# EAGLE design BT121breakout (EAGLE 7.7.0)
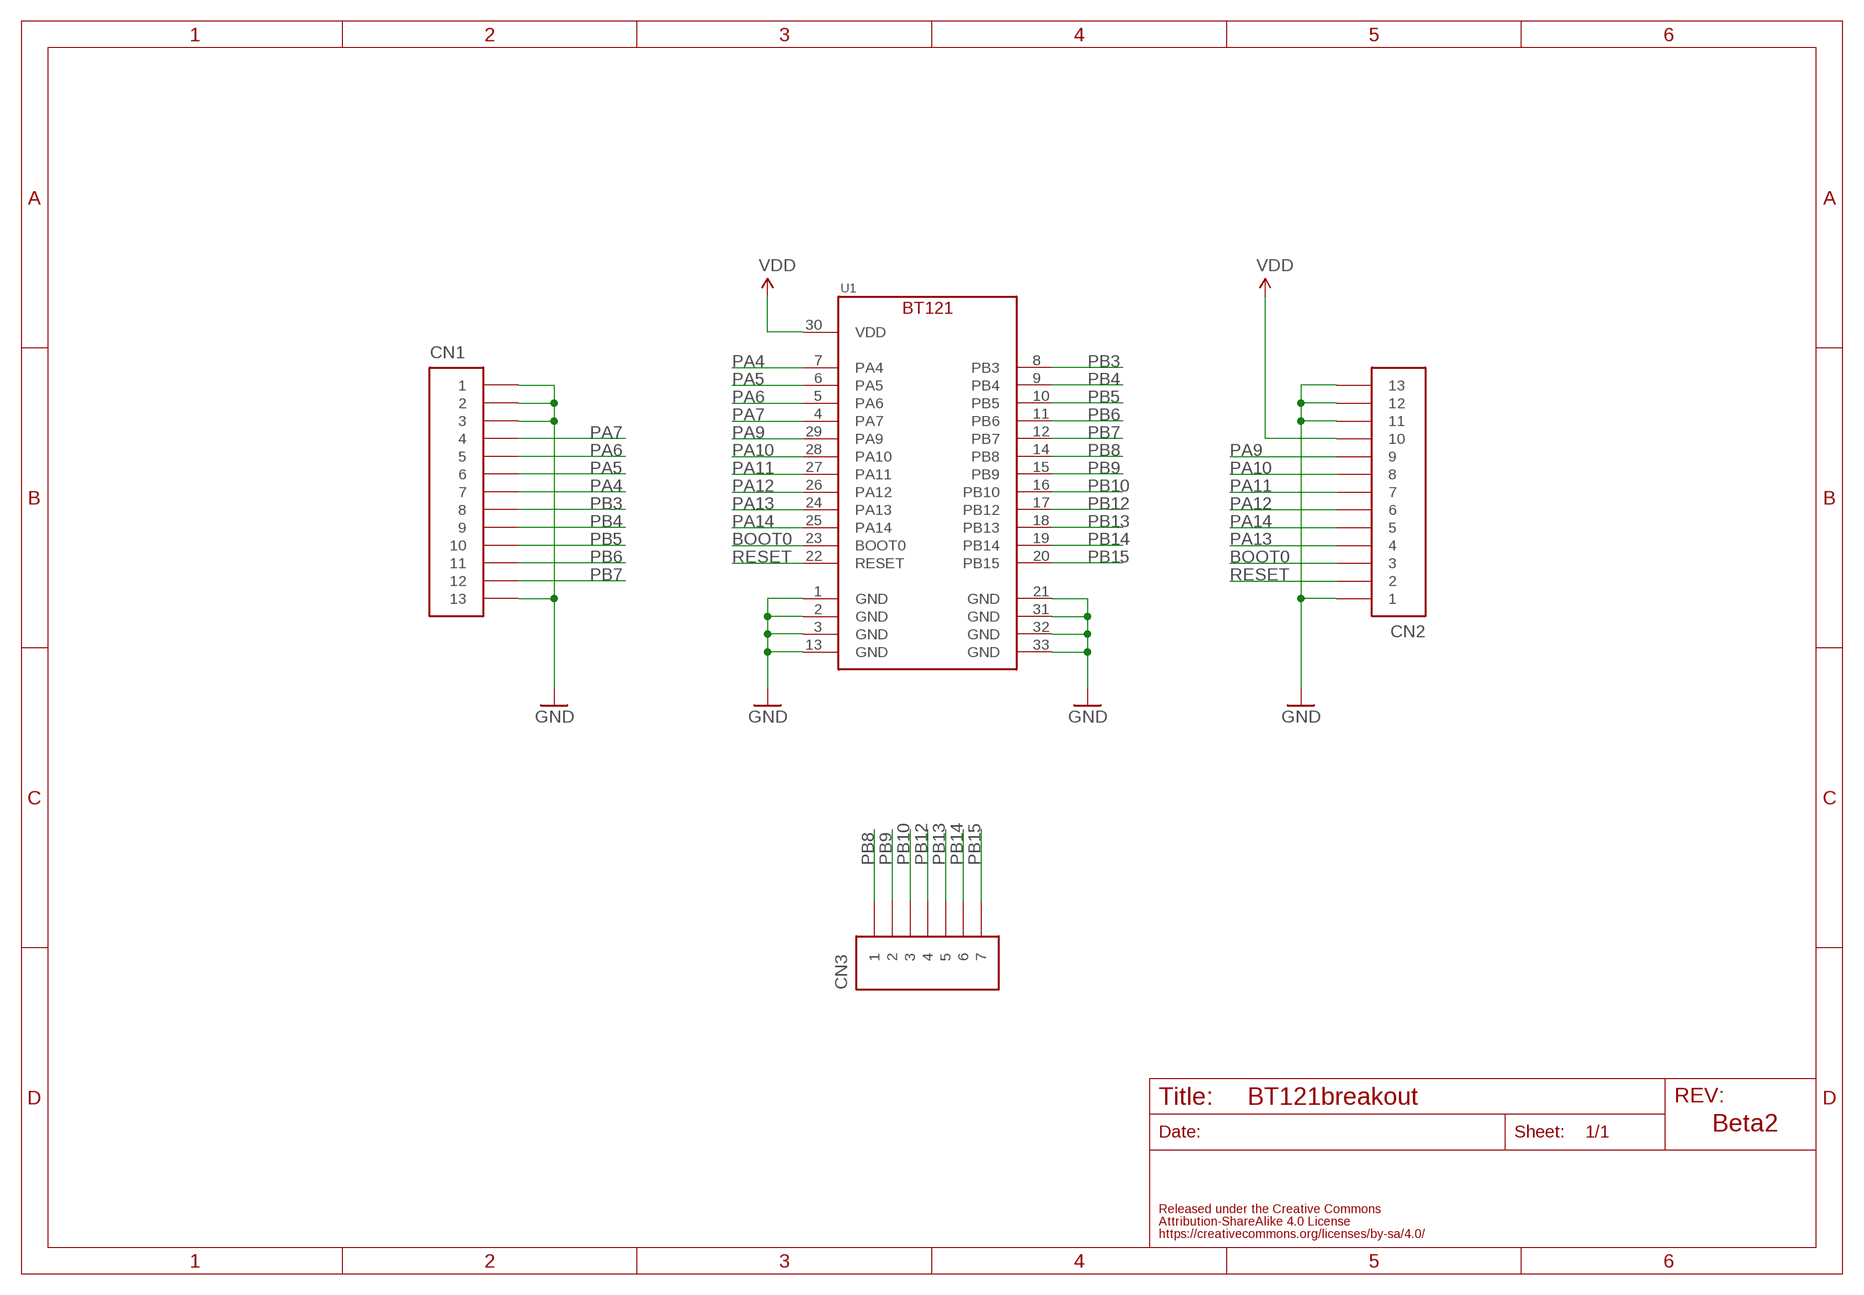
[diagram p0: schematic, sheet 1]

## Parts
CN1  PIN_HEADER_1X13  [PIN_1X13]
CN2  PIN_HEADER_1X13  [PIN_1X13]
CN3  PIN_HEADER_1X7  [PIN_1X7]
U1  SILICONLABS-BT121  [SILICONLABS-BT121]

## Nets
BOOT0: CN2.3 U1.23(BOOT0)
GND: CN1.1 CN1.2 CN1.3 CN1.13 CN2.1 CN2.11 CN2.12 CN2.13 U1.1(GND) U1.2(GND) U1.3(GND) U1.13(GND) U1.21(GND) U1.31(GND) U1.32(GND) U1.33(GND)
PA4: CN1.7 U1.7(PA4)
PA5: CN1.6 U1.6(PA5)
PA6: CN1.5 U1.5(PA6)
PA7: CN1.4 U1.4(PA7)
PA9: CN2.9 U1.29(PA9)
PA10: CN2.8 U1.28(PA10)
PA11: CN2.7 U1.27(PA11)
PA12: CN2.6 U1.26(PA12)
PA13: CN2.4 U1.24(PA13)
PA14: CN2.5 U1.25(PA14)
PB3: CN1.8 U1.8(PB3)
PB4: CN1.9 U1.9(PB4)
PB5: CN1.10 U1.10(PB5)
PB6: CN1.11 U1.11(PB6)
PB7: CN1.12 U1.12(PB7)
PB8: CN3.1 U1.14(PB8)
PB9: CN3.2 U1.15(PB9)
PB10: CN3.3 U1.16(PB10)
PB12: CN3.4 U1.17(PB12)
PB13: CN3.5 U1.18(PB13)
PB14: CN3.6 U1.19(PB14)
PB15: CN3.7 U1.20(PB15)
RESET: CN2.2 U1.22(RESET)
VDD: CN2.10 U1.30(VDD)

## Notes on the sheet
- Beta2

## Library data of the parts
CN1 CN2 = FaBo-PIN:PIN_HEADER_1X13
CN3 = FaBo-PIN:PIN_HEADER_1X7
U1 = FaBo-BT:SILICONLABS-BT121

## Board
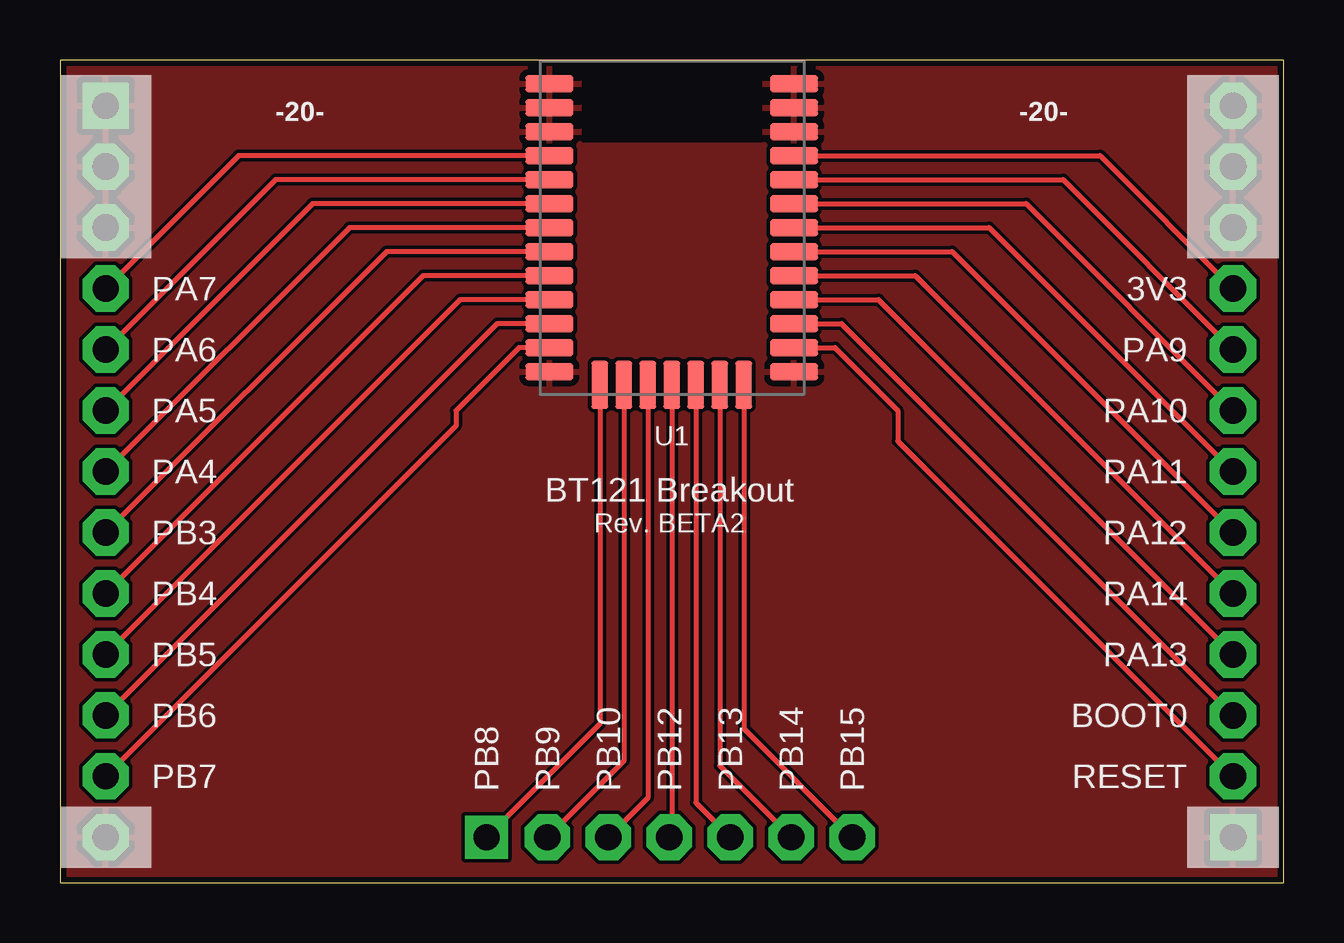
[diagram p1: board, top side]
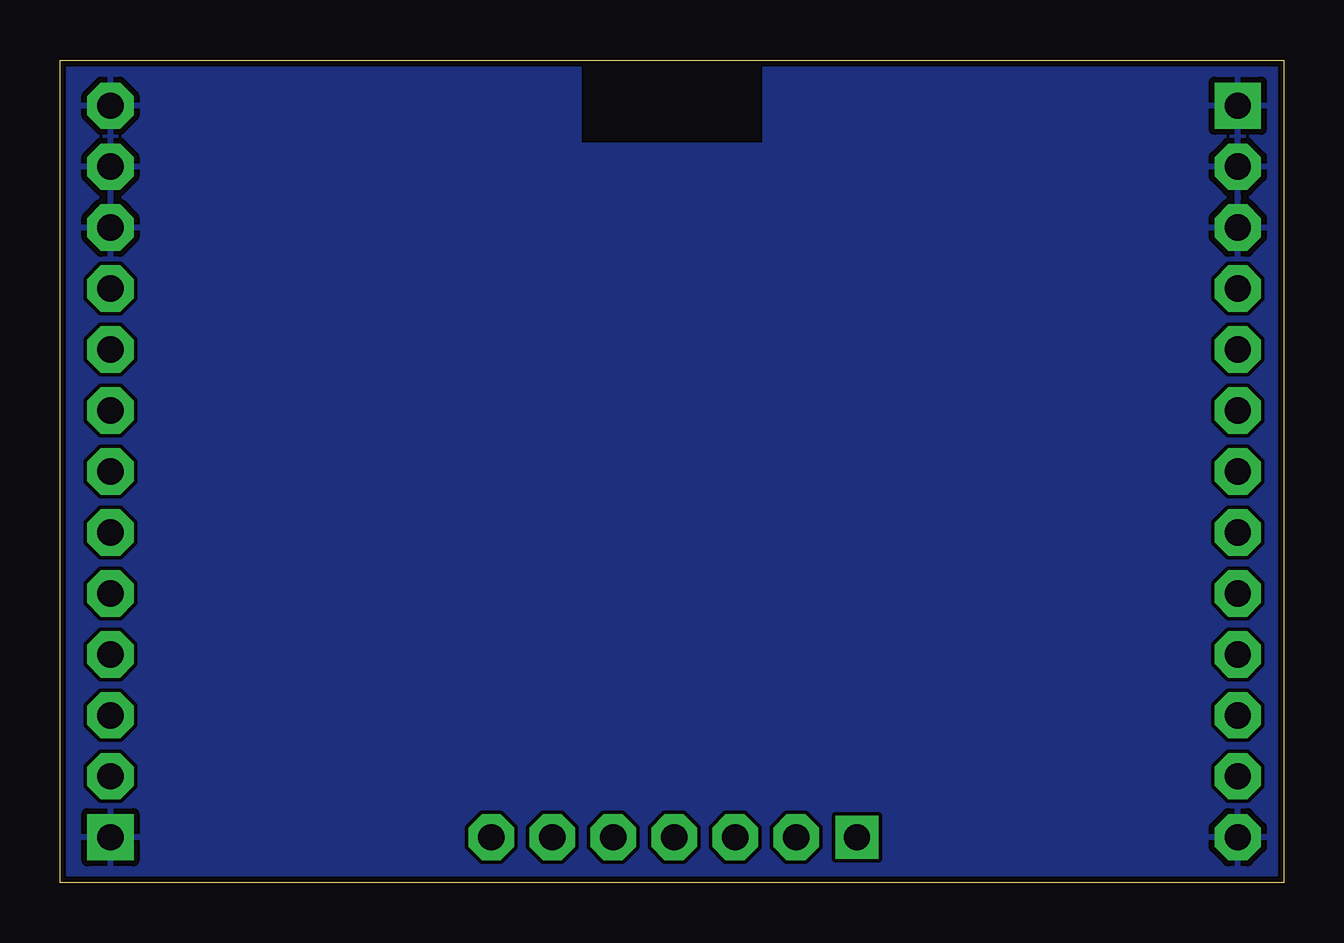
[diagram p2: board, bottom side, seen from below]

Size 51 x 34.29 mm. Coordinates in mm from the lower left corner, seen from the top.
Outline: 0,0 51,0 51,34.29 0,34.29 0,0
Copper layers (1*16): Top 0.035mm / dielectric 1.5mm / Bottom 0.035mm
Design rules "Elecrow_angle": minimum track width 6mil, minimum drill 12mil, track to track 6mil, track to pad 6mil, pad to pad 6mil, via to via 6mil, smd to smd 0mil, copper to edge 10mil, drill to drill 10mil, minimum pad ring 10mil, minimum via ring 6mil, stop-mask expansion 2mil, vias tented up to drill 100mil, thermal gap 10mil

### Footprints (pad centres in the part's own frame; a part is rotated, then mirrored left to right if it is on the bottom)
PIN_1X13 = drill 1.1 pad 1.93 square: 1 -15.24,0 | drill 1.1 pad 1.93 octagon: 2 -12.7,0; 3 -10.16,0; 4 -7.62,0; 5 -5.08,0; 6 -2.54,0; 7 0,0; 8 2.54,0; 9 5.08,0; 10 7.62,0; 11 10.16,0; 12 12.7,0; 13 15.24,0
PIN_1X7 = drill 1.1 pad 1.778 square: 1 -7.62,0 | drill 1.1 pad 1.9 octagon: 2 -5.08,0; 3 -2.54,0; 4 0,0; 5 2.54,0; 6 5.08,0; 7 7.62,0
SILICONLABS-BT121 = smd 2 x 0.7: 1 -5.1,6; 2 -5.1,5; 3 -5.1,4; 4 -5.1,3; 5 -5.1,2; 6 -5.1,1; 7 -5.1,0; 8 -5.1,-1; 9 -5.1,-2; 10 -5.1,-3; 11 -5.1,-4; 12 -5.1,-5; 13 -5.1,-6; 21 5.1,-6; 22 5.1,-5; 23 5.1,-4; 24 5.1,-3; 25 5.1,-2; 26 5.1,-1; 27 5.1,0; 28 5.1,1; 29 5.1,2; 30 5.1,3; 31 5.1,4; 32 5.1,5; 33 5.1,6 | smd 0.7 x 2: 14 -3,-6.55; 15 -2,-6.55; 16 -1,-6.55; 17 0,-6.55; 18 1,-6.55; 19 2,-6.55; 20 3,-6.55

### Placement (x,y rotation side)
CN1  1.91,17.14 270 top
CN2  48.9,17.14 90 top
CN3  25.4,1.91 0 top
U1  25.5,27.3 0 top

### Tracks (layer width: path | path; a pad name or v marks a point on that pad's centre or on a via)
BOOT0
  Top 0.203: U1.23 32.58,23.3 CN2.3
GND
  pour Bottom: 0,0 51,0 51,34.29 0,34.29
  pour Top: 0,0 51,0 51,34.29 0,34.29
PA4
  Top 0.203: U1.7 12.06,27.3 CN1.7
PA5
  Top 0.203: U1.6 10.53,28.3 CN1.6
PA6
  Top 0.203: U1.5 8.98,29.3 CN1.5
PA7
  Top 0.203: U1.4 7.45,30.3 CN1.4
PA9
  Top 0.203: U1.29 41.81,29.3 CN2.9
PA10
  Top 0.203: U1.28 40.27,28.3 CN2.8
PA11
  Top 0.203: U1.27 38.73,27.3 CN2.7
PA12
  Top 0.203: U1.26 37.2,26.3 CN2.6
PA13
  Top 0.203: U1.24 34.12,24.3 CN2.4
PA14
  Top 0.203: U1.25 35.66,25.3 CN2.5
PB3
  Top 0.203: U1.8 13.61,26.3 CN1.8
PB4
  Top 0.203: U1.9 15.14,25.3 CN1.9
PB5
  Top 0.203: U1.10 16.68,24.3 CN1.10
PB6
  Top 0.203: U1.11 18.23,23.3 CN1.11
PB7
  Top 0.203: U1.12 19.13,22.3 16.51,19.68 16.51,19.05 CN1.12
PB8
  Top 0.203: U1.14 22.5,6.62 CN3.1
PB9
  Top 0.203: U1.15 23.5,5.08 CN3.2
PB10
  Top 0.203: U1.16 24.5,3.54 CN3.3
PB12
  Top 0.203: U1.17 25.5,2 CN3.4
PB13
  Top 0.203: U1.18 26.5,3.35 CN3.5
PB14
  Top 0.203: U1.19 27.5,4.88 CN3.6
PB15
  Top 0.203: U1.20 28.5,6.42 CN3.7
RESET
  Top 0.203: U1.22 32.3,22.3 34.92,19.68 34.92,18.41 CN2.2
VDD
  Top 0.203: U1.30 43.35,30.3 CN2.10

### Text on the board
tPlace: -20- | -20- | PA7 | 3V3 | PA6 | PA9 | PA5 | PA10 | PA4 | PA11 | BT121 Breakout | PB3 | Rev. BETA2 | PA12 | PB4 | PA14 | PB5 | PA13 | PB6 | BOOT0 | PB7 | PB8 | PB9 | PB10 | PB12 | PB13 | PB14 | PB15 | RESET